# Altium schematic sheet Connectors.SchDoc
size A
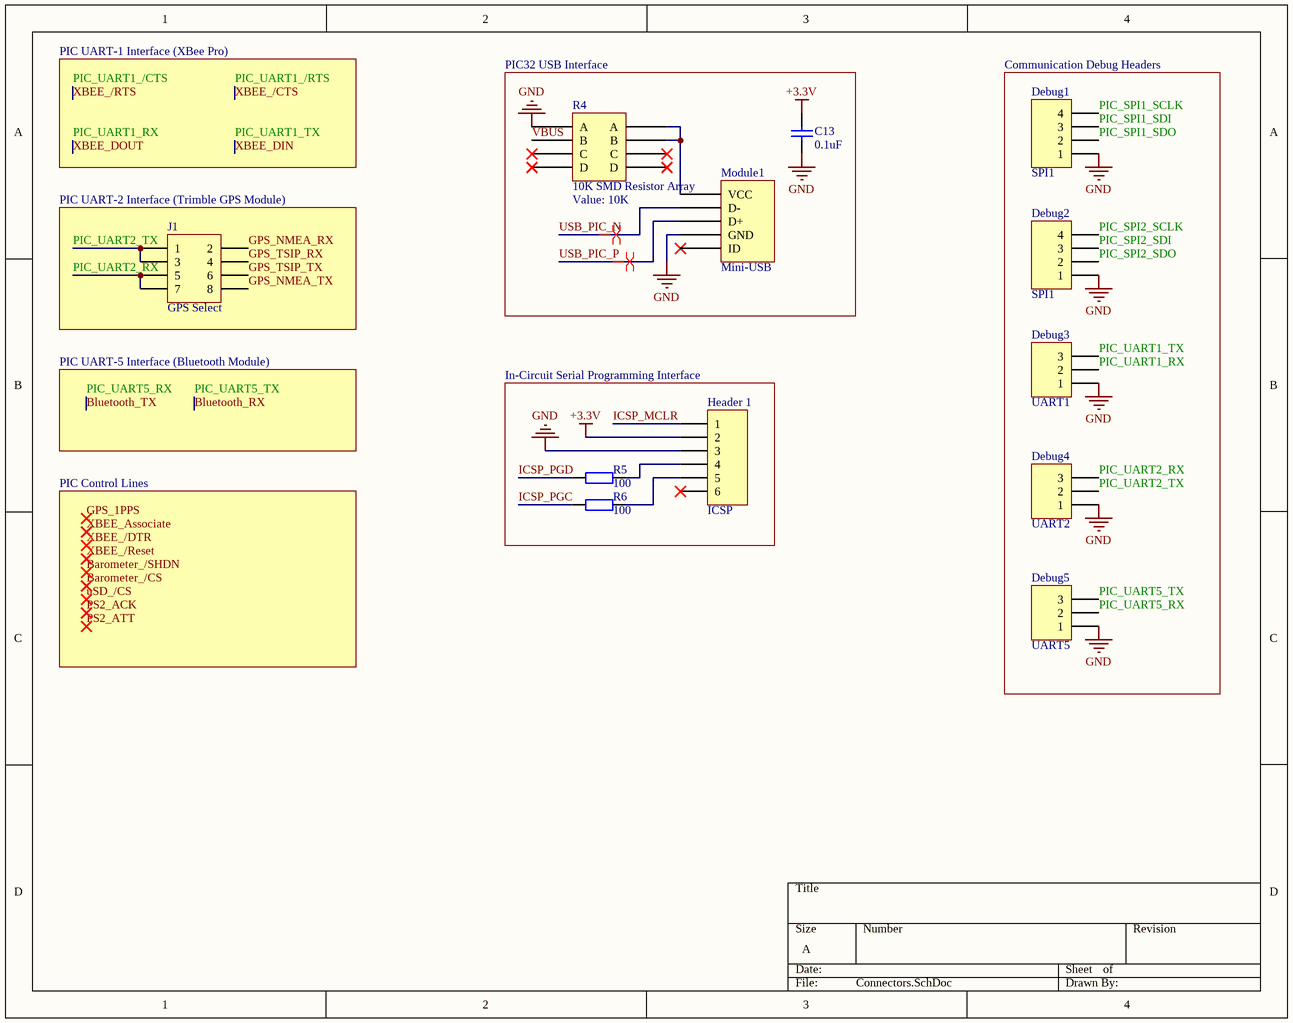
[diagram p0: Connectors.SchDoc]

## Parts
C13  value 0.1uF  [SMD 1206]  (hidden comment: 0.1uF SMD 1206)
Debug1  SPI1  [HDR1X4]
Debug2  SPI1  [HDR1X4]
Debug3  UART1  [HDR1X3]
Debug4  UART2  [HDR1X3]
Debug5  UART5  [HDR1X3]
Header_1  ICSP  [HDR1X6H]
J1  GPS Select  [HDR2X4]
Module1  Mini-USB  [Mini B USB Connector]
R4  10K SMD Resistor Array  value 10K  [Resistor Array YC164]
R5  value 100  [SMD 0805]  (hidden comment: 100 SMD 0805)
R6  value 100  [SMD 0805]  (hidden comment: 100 SMD 0805)

## Blocks framed on the sheet
PIC32 USB Interface: C13 Module1 R4
Communication Debug Headers: Debug1-Debug5
PIC UART-2 Interface (Trimble GPS Module): J1
In-Circuit Serial Programming Interface: Header_1 R5 R6

## Nets
+3.3V: C13.2 Header_1.2
GND: C13.1 Debug1.1 Debug2.1 Debug3.1 Debug4.1 Debug5.1 Header_1.3 Module1.0(GND) R4.5(A)
Bluetooth_RX: Debug5.3  [also labelled PIC_UART5_TX]
Bluetooth_TX: Debug5.2  [also labelled PIC_UART5_RX]
GPS_NMEA_RX: J1.2
GPS_NMEA_TX: J1.8
GPS_TSIP_RX: J1.4
GPS_TSIP_TX: J1.6
ICSP_MCLR: Header_1.1
ICSP_PGC: R6.2
ICSP_PGD: R5.2
PIC_SPI1_SCLK: Debug1.4
PIC_SPI1_SDI: Debug1.3
PIC_SPI1_SDO: Debug1.2
PIC_SPI2_SCLK: Debug2.4
PIC_SPI2_SDI: Debug2.3
PIC_SPI2_SDO: Debug2.2
PIC_UART1_RX: Debug3.2  [also labelled XBEE_DOUT]
PIC_UART1_TX: Debug3.3  [also labelled XBEE_DIN]
PIC_UART2_RX: Debug4.3 J1.5 J1.7
PIC_UART2_TX: Debug4.2 J1.1 J1.3
USB_PIC_N: Module1.3(D-)
USB_PIC_P: Module1.2(D+)
VBUS: R4.6(B)
NetHeader_1_4: Header_1.4 R5.1
NetHeader_1_5: Header_1.5 R6.1
NetModule1_4: Module1.4(VCC) R4.1(A) R4.2(B)

Not connected (* = marked no-connect by the designer): Header_1 6*; Module1 1(ID)*; R4 3(C)* 4(D)* 7(C)* 8(D)*

## Layout directives
differential pair: USB_PIC_N, USB_PIC_P

## Notes on the sheet
- PIC UART-1 Interface (XBee Pro)
- PIC UART-5 Interface (Bluetooth Module)
- PIC Control Lines
- Labels drawn without touching a wire or pin: Barometer_/CS, Barometer_/SHDN, GPS_1PPS, PS2_ACK, PS2_ATT, uSD_/CS, XBEE_/DTR, XBEE_/Reset, XBEE_Associate

## Library data of the parts
C13 = Cap: Capacitor
Debug1 Debug2 = Header 4: Header, 4-Pin; LatestRevisionDate: 17-Jul-2002; LatestRevisionNote: Re-released for DXP Platform.; Publisher: Altium Limited
Debug3-Debug5 = Header 3: Header, 3-Pin; LatestRevisionDate: 17-Jul-2002; LatestRevisionNote: Re-released for DXP Platform.; Publisher: Altium Limited
Header_1 = Header 6: Header, 6-Pin; LatestRevisionDate: 17-Jul-2002; LatestRevisionNote: Re-released for DXP Platform.; Publisher: Altium Limited
J1 = Header 4X2: Header, 4-Pin, Dual row; LatestRevisionDate: 17-Jul-2002; LatestRevisionNote: Re-released for DXP Platform.; Publisher: Altium Limited
Module1 = Mini USB Connector: pin to pad: 0>1 1>2 2>3 3>4 4>5
R4 = SMD Resistor Array: 4-Count Resistor Array; pin to pad: 5>8 6>7 7>6 8>5
R5 R6 = Res2: Resistor